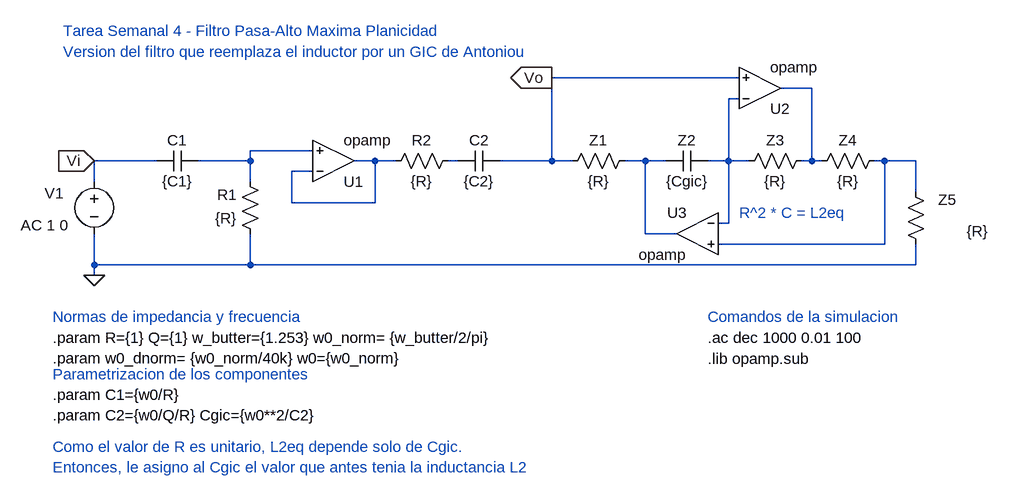
[diagram p0: schematic pasaalto_con_gic.asc]
pasaalto_con_gic.asc, the LTspice schematic file:
Version 4
SHEET 1 1476 680
WIRE 912 -64 624 -64
WIRE 1024 -48 976 -48
WIRE 912 -32 896 -32
WIRE 256 48 160 48
WIRE 16 64 -80 64
WIRE 160 64 160 48
WIRE 160 64 80 64
WIRE 352 64 320 64
WIRE 384 64 352 64
WIRE 480 64 464 64
WIRE 624 64 624 -64
WIRE 624 64 544 64
WIRE 656 64 624 64
WIRE 768 64 736 64
WIRE 800 64 768 64
WIRE 896 64 896 -32
WIRE 896 64 864 64
WIRE 928 64 896 64
WIRE 1024 64 1024 -48
WIRE 1024 64 1008 64
WIRE 1040 64 1024 64
WIRE 1136 64 1120 64
WIRE 1184 64 1136 64
WIRE 256 80 224 80
WIRE -80 96 -80 64
WIRE 160 96 160 64
WIRE 1184 112 1184 64
WIRE 224 128 224 80
WIRE 352 128 352 64
WIRE 352 128 224 128
WIRE 896 160 896 64
WIRE 896 160 880 160
WIRE 768 176 768 64
WIRE 816 176 768 176
WIRE 1136 192 1136 64
WIRE 1136 192 880 192
WIRE -80 224 -80 176
WIRE 160 224 160 176
WIRE 160 224 -80 224
WIRE 1184 224 1184 192
WIRE 1184 224 160 224
WIRE -80 240 -80 224
FLAG -80 64 Vi
IOPIN -80 64 In
FLAG -80 240 0
FLAG 624 -64 Vo
IOPIN 624 -64 Out
SYMBOL res 176 192 R180
WINDOW 0 36 76 Left 2
WINDOW 3 36 40 Left 2
SYMATTR InstName R1
SYMATTR Value {R}
SYMBOL res 480 48 R90
WINDOW 0 0 56 VBottom 2
WINDOW 3 32 56 VTop 2
SYMATTR InstName R2
SYMATTR Value {R}
SYMBOL cap 80 48 R90
WINDOW 0 0 32 VBottom 2
WINDOW 3 32 32 VTop 2
SYMATTR InstName C1
SYMATTR Value {C1}
SYMBOL cap 544 48 R90
WINDOW 0 0 32 VBottom 2
WINDOW 3 32 32 VTop 2
SYMATTR InstName C2
SYMATTR Value {C2}
SYMBOL Opamps\\opamp 288 128 M180
SYMATTR InstName U1
SYMBOL voltage -80 80 R0
WINDOW 0 -76 34 Left 2
WINDOW 3 -82 83 Left 2
WINDOW 123 -113 83 Left 2
WINDOW 39 0 0 Left 0
SYMATTR InstName V1
SYMATTR Value ""
SYMATTR Value2 AC 1 0
SYMBOL res 752 48 R90
WINDOW 0 0 56 VBottom 2
WINDOW 3 32 56 VTop 2
SYMATTR InstName Z1
SYMATTR Value {R}
SYMBOL res 1024 48 R90
WINDOW 0 0 56 VBottom 2
WINDOW 3 32 56 VTop 2
SYMATTR InstName Z3
SYMATTR Value {R}
SYMBOL res 1136 48 R90
WINDOW 0 0 56 VBottom 2
WINDOW 3 32 56 VTop 2
SYMATTR InstName Z4
SYMATTR Value {R}
SYMBOL res 1200 208 R180
WINDOW 0 -47 84 Left 2
WINDOW 3 -96 36 Left 2
SYMATTR InstName Z5
SYMATTR Value {R}
SYMBOL cap 864 48 R90
WINDOW 0 0 32 VBottom 2
WINDOW 3 32 32 VTop 2
SYMATTR InstName Z2
SYMATTR Value {Cgic}
SYMBOL Opamps\\opamp 944 16 M180
SYMATTR InstName U2
SYMBOL Opamps\\opamp 848 112 M0
SYMATTR InstName U3
TEXT 864 368 Left 2 !.lib opamp.sub
TEXT 864 336 Left 2 !.ac dec 1000 0.01 100
TEXT -128 -104 Left 2 ;Version del filtro que reemplaza el inductor por un GIC de Antoniou
TEXT -128 -136 Left 2 ;Tarea Semanal 4 - Filtro Pasa-Alto Maxima Planicidad
TEXT 864 304 Left 2 ;Comandos de la simulacion
TEXT -144 336 Left 2 !.param R={1} Q={1} w_butter={1.253} w0_norm= {w_butter/2/pi}\n.param w0_dnorm= {w0_norm/40k} w0={w0_norm}
TEXT -144 424 Left 2 !.param C1={w0/R}\n.param C2={w0/Q/R} Cgic={w0**2/C2}
TEXT -144 304 Left 2 ;Normas de impedancia y frecuencia
TEXT -144 392 Left 2 ;Parametrizacion de los componentes
TEXT 912 144 Left 2 ;R^2 * C = L2eq
TEXT -144 504 Left 2 ;Como el valor de R es unitario, L2eq depende solo de Cgic.\nEntonces, le asigno al Cgic el valor que antes tenia la inductancia L2

The netlist it stands for:
* pasaalto_con_gic.asc
R1 0 N003 {R}
R2 N005 N004 {R}
C1 N003 Vi {C1}
C2 Vo N005 {C2}
XU1 N004 N003 N004 opamp Aol=100K GBW=10Meg  ; pins invin noninvin out
V1 Vi 0 AC 1 0
R§Z1 N006 Vo {R}
R§Z3 N001 N002 {R}
R§Z4 N007 N001 {R}
R§Z5 0 N007 {R}
C§Z2 N002 N006 {Cgic}
XU2 N002 Vo N001 opamp Aol=100K GBW=10Meg  ; pins invin noninvin out
XU3 N002 N007 N006 opamp Aol=100K GBW=10Meg  ; pins invin noninvin out
.lib opamp.sub
.ac dec 1000 0.01 100
* Version del filtro que reemplaza el inductor por un GIC de Antoniou
* Tarea Semanal 4 - Filtro Pasa-Alto Maxima Planicidad
* Comandos de la simulacion
.param R={1} Q={1} w_butter={1.253} w0_norm= {w_butter/2/pi}
.param w0_dnorm= {w0_norm/40k} w0={w0_norm}
.param C1={w0/R}
.param C2={w0/Q/R} Cgic={w0**2/C2}
* Normas de impedancia y frecuencia
* Parametrizacion de los componentes
* R^2 * C = L2eq
* Como el valor de R es unitario, L2eq depende solo de Cgic.
* Entonces, le asigno al Cgic el valor que antes tenia la inductancia L2
.backanno
.end